# EasyEDA Pro project 功率选择.eprj

# Schematic Schematic1
Create Date: 2024-05-03; Page Name: P1; Project Name: 功率选择; Schematic Name: Schematic1; Update Date: 2024-05-03; Company: 嘉立创EDA; Page Size: A4; Version: V1.0
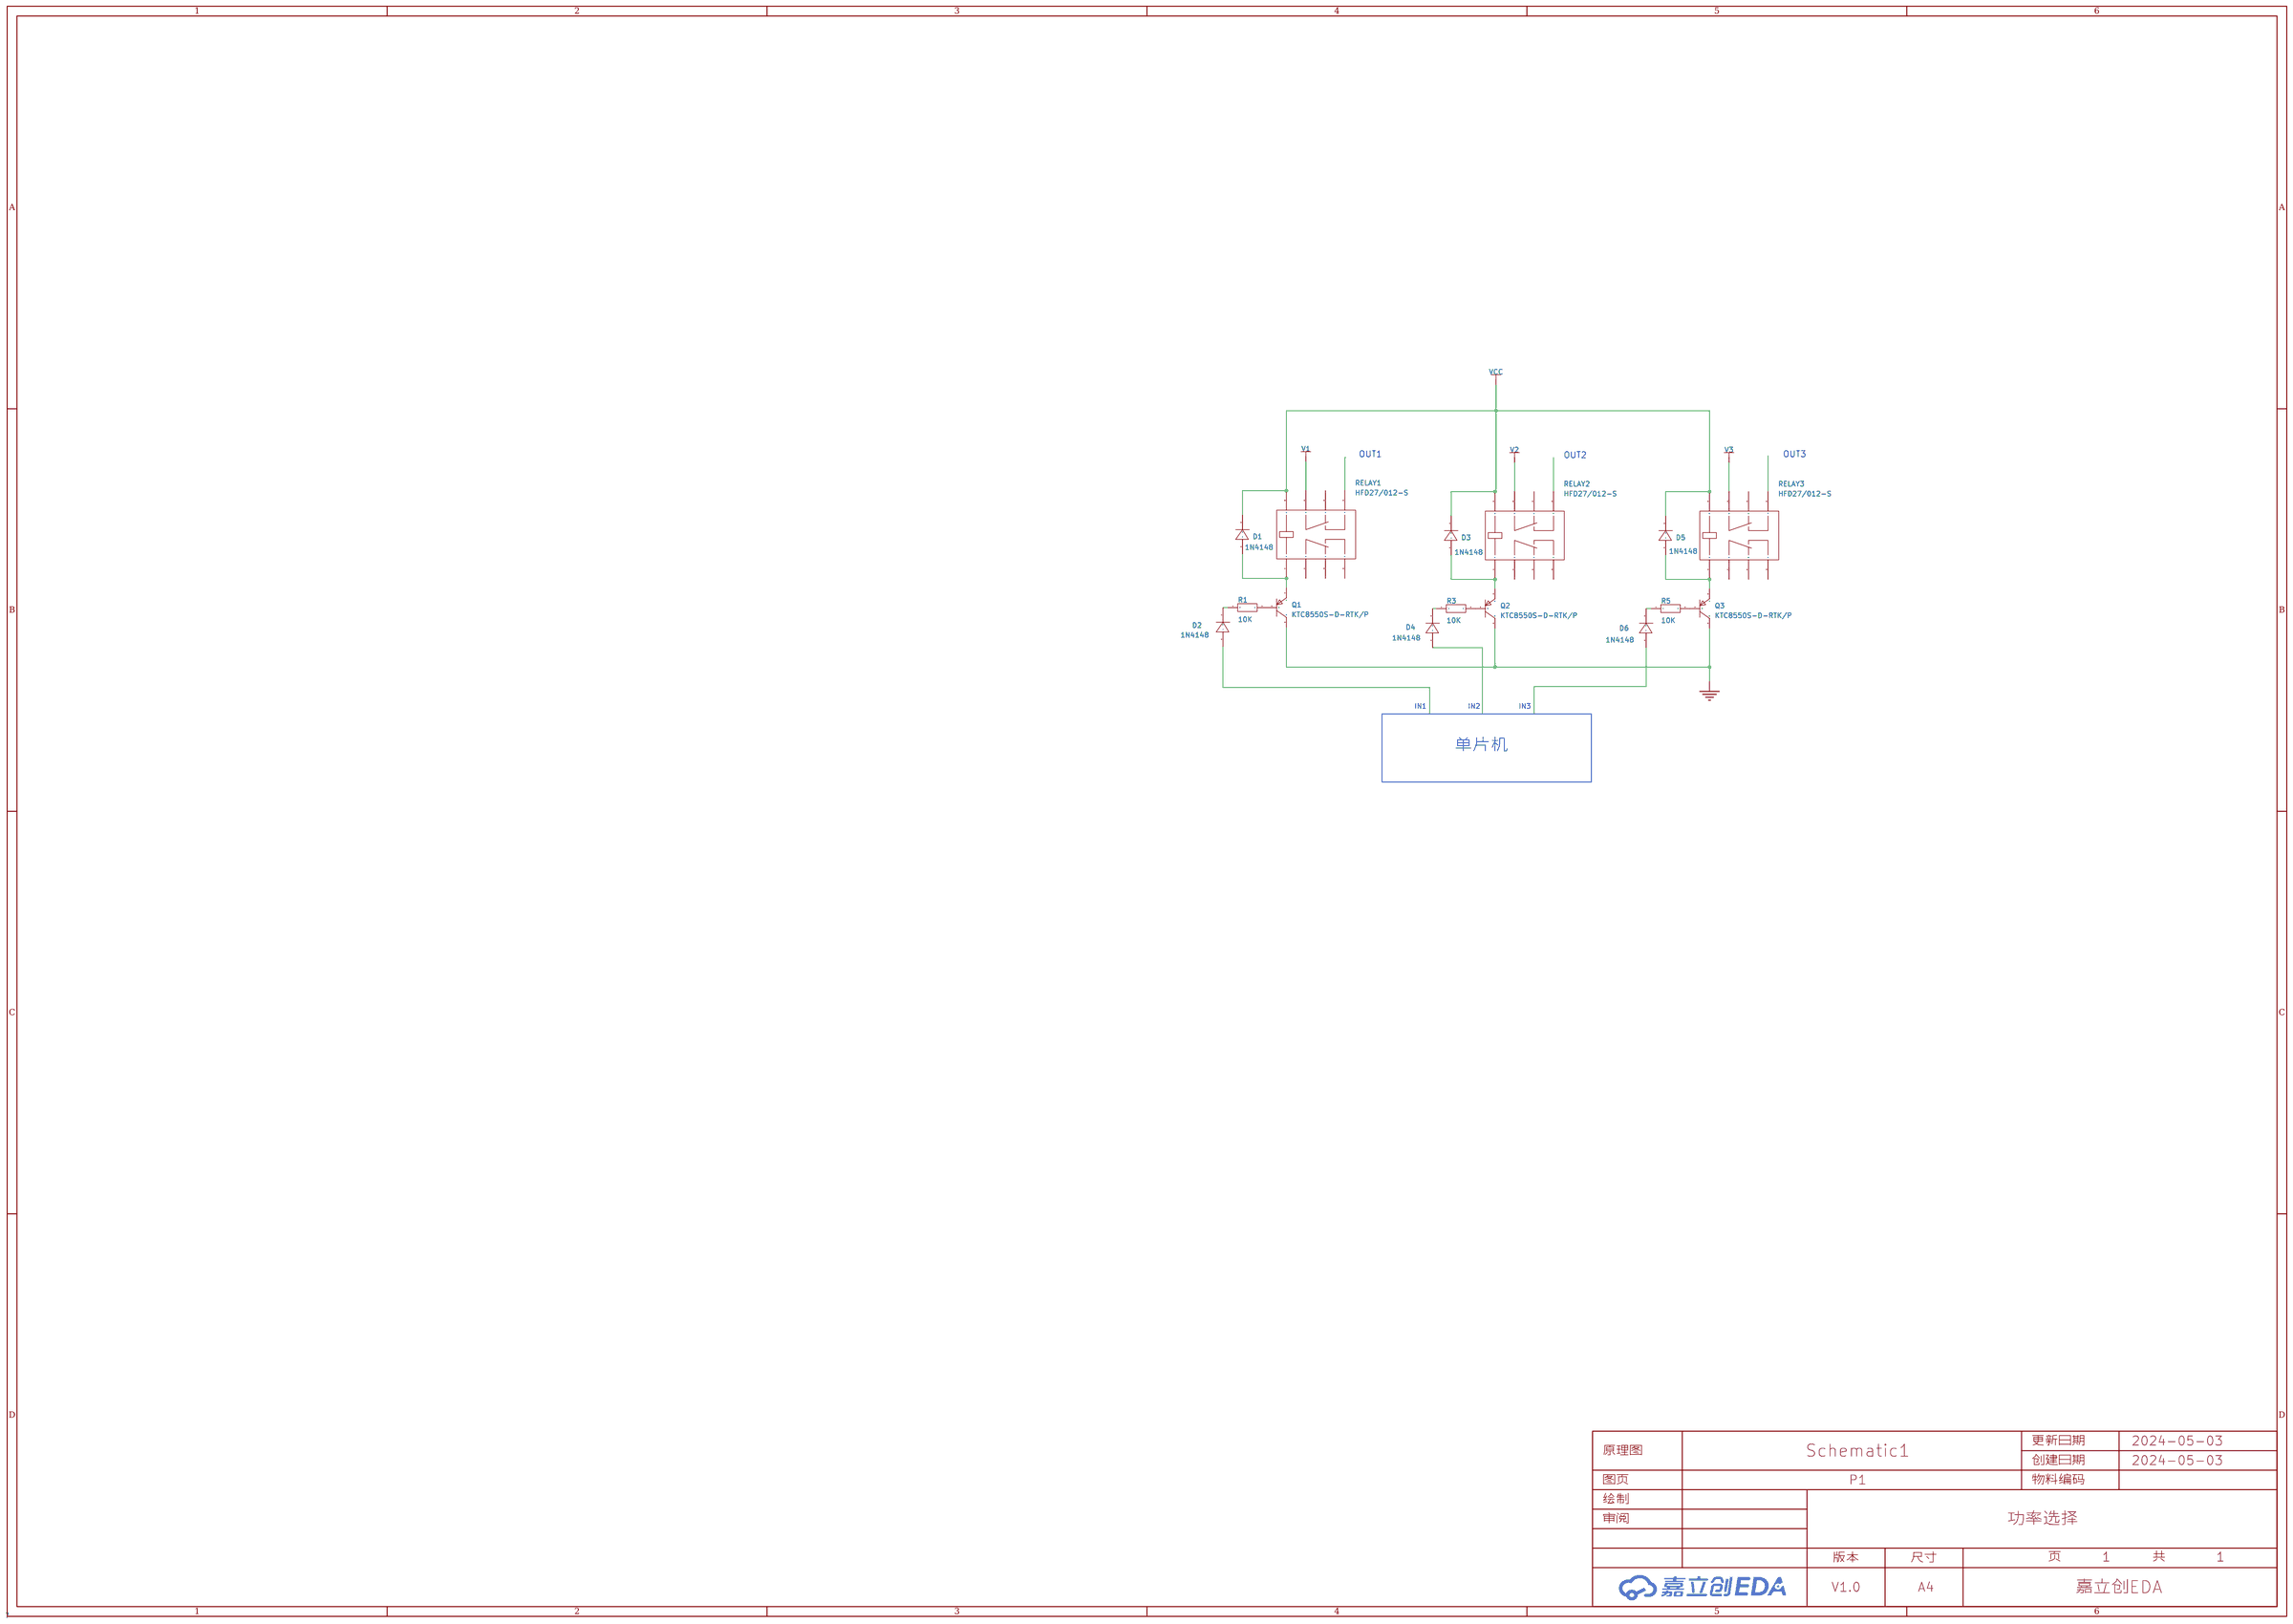
[diagram p0: schematic sheet]

## Parts
D1  1N4148  [DO-35_BD2.0-L4.2-P8.20-D0.5-RD]
D2  1N4148  [DO-35_BD2.0-L4.2-P8.20-D0.5-RD]
D3  1N4148  [DO-35_BD2.0-L4.2-P8.20-D0.5-RD]
D4  1N4148  [DO-35_BD2.0-L4.2-P8.20-D0.5-RD]
D5  1N4148  [DO-35_BD2.0-L4.2-P8.20-D0.5-RD]
D6  1N4148  [DO-35_BD2.0-L4.2-P8.20-D0.5-RD]
Q1  KTC8550S-D-RTK/P  [SOT-23-3_L2.9-W1.3-P1.90-LS2.4-TR-CW]
Q2  KTC8550S-D-RTK/P  [SOT-23-3_L2.9-W1.3-P1.90-LS2.4-TR-CW]
Q3  KTC8550S-D-RTK/P  [SOT-23-3_L2.9-W1.3-P1.90-LS2.4-TR-CW]
R1  10K  [R0603]
R3  10K  [R0603]
R5  10K  [R0603]
RELAY1  HFD27/012-S  [RELAY-TH_HFD27-012-S]
RELAY2  HFD27/012-S  [RELAY-TH_HFD27-012-S]
RELAY3  HFD27/012-S  [RELAY-TH_HFD27-012-S]

## Library data of the parts
D1-D6 = 1N4148_C402212: 二极管配置:-;正向压降(Vf):1V@10mA;直流反向耐压(Vr):75V;平均整流电流(Io):150mA;功率:500mW;反向恢复时间(trr):4ns;; LCSC Part Name: 电压:75V 电流:150mA; Supplier Part: C402212; Manufacturer: LGE(鲁光); Supplier Footprint: DO-35; JLCPCB Part Class: 扩展库; Datasheet: https://atta.szlcsc.com/upload/public/pdf/source/20190705/C402212_D6CD0A8EA8714742E0940C7C02C37BFA.pdf; Supplier: LCSC; Forward Voltage (Vf@If): 1V@10mA; Reverse Voltage (Vr): 75V; Average Rectified Current (Io): 150mA; Power Dissipation: 500mW; Reverse Leakage Current: 5uA@75V; Reverse Recovery Time (trr): 4ns
Q1-Q3 = KTC8550S-D-RTK/P: 晶体管类型:PNP;集电极电流(Ic):800mA;集射极击穿电压(Vceo):30V;功率(Pd):350mW;直流电流增益(hFE@Ic,Vce):100@50mA,1V;; LCSC Part Name: PNP 电流:800mA 耐压:30V hfe=150~300; Supplier Part: C69773; Manufacturer: KEC; Supplier Footprint: SOT-23; JLCPCB Part Class: 扩展库; Datasheet: https://atta.szlcsc.com/upload/public/pdf/source/20180105/C112859_15151571741411234365.pdf; Supplier: LCSC; Transistor Type: PNP; Collector Current (Ic): 800mA; Collector-Emitter Breakdown Voltage (Vceo): 30V; Power Dissipation (Pd): 350mW; DC Current Gain (hFE@Ic,Vce): 100@50mA,1V; Transition Frequency (fT): 120MHz; Collector Cut-Off Current (Icbo): 50nA; Collector-Emitter Saturation Voltage (VCE(sat)@Ic,Ib): 500mV@500mA,50mA
R1 R3 R5 = Res_0603: Supplier Footprint: 0603
RELAY1-RELAY3 = HFD27/012-S: 线圈电压:12V;触点形式:两组转换:2C(双刀双掷-转换);触点容量(电阻负载):2A@30VDC；1A@125VAC;最大切换电压:120V@DC；240V@AC;最大切换电流:2A;; LCSC Part Name: 12V继电器 双刀双掷; Supplier Part: C13466; Manufacturer: HF(宏发); Supplier Footprint: DIP,10.2x20.2mm; JLCPCB Part Class: 扩展库; Datasheet: https://atta.szlcsc.com/upload/public/pdf/source/20151106/1457707544631.pdf; Supplier: LCSC; Coil Voltage: 12V; Contact Form: 两组转换:2C(双刀双掷-转换); Pin Number: 8; Contact Rating: 2A@30VDC；1A@125VAC; Maximum Switching Voltage: 120V@DC；240V@AC; Coil Rated Power: 200mW; Contact Material: AgNi+镀金; Maximum Switching Current: 2A; Coil Type: 无极性-单线圈; Coil Resistance: 720Ω; Contact Resistance: 100mΩ; Operate Time: 7ms; Release Time: 4ms; Operating Temperature: -40℃~+85℃

## Nets
GND: Q1.3(C) Q2.3(C) Q3.3(C)
V1: RELAY1.13
V2: RELAY2.13
V3: RELAY3.13
VCC: D1.1(C) D3.1(C) D5.1(C) RELAY1.16 RELAY2.16 RELAY3.16
Net-(D1-2): D1.2(A) Q1.1(E) RELAY1.1
Net-(D2-1): D2.1(C) R1.1
Net-(D3-2): D3.2(A) Q2.1(E) RELAY2.1
Net-(D4-1): D4.1(C) R3.1
Net-(D5-2): D5.2(A) Q3.1(E) RELAY3.1
Net-(D6-1): D6.1(C) R5.1
Net-(Q1-2): Q1.2(B) R1.2
Net-(Q2-2): Q2.2(B) R3.2
Net-(Q3-2): Q3.2(B) R5.2

Not connected (* = marked no-connect by the designer): D2 2(A); D4 2(A); D6 2(A); RELAY1 4 6 8 9 11; RELAY2 4 6 8 9 11; RELAY3 4 6 8 9 11

## Notes on the sheet
- OUT1
- OUT2
- OUT3
- IN1
- IN2
- IN3
- 单片机
